# EAGLE design NotSoSmartWatch-BASIC-TOP (EAGLE 9.6.2)
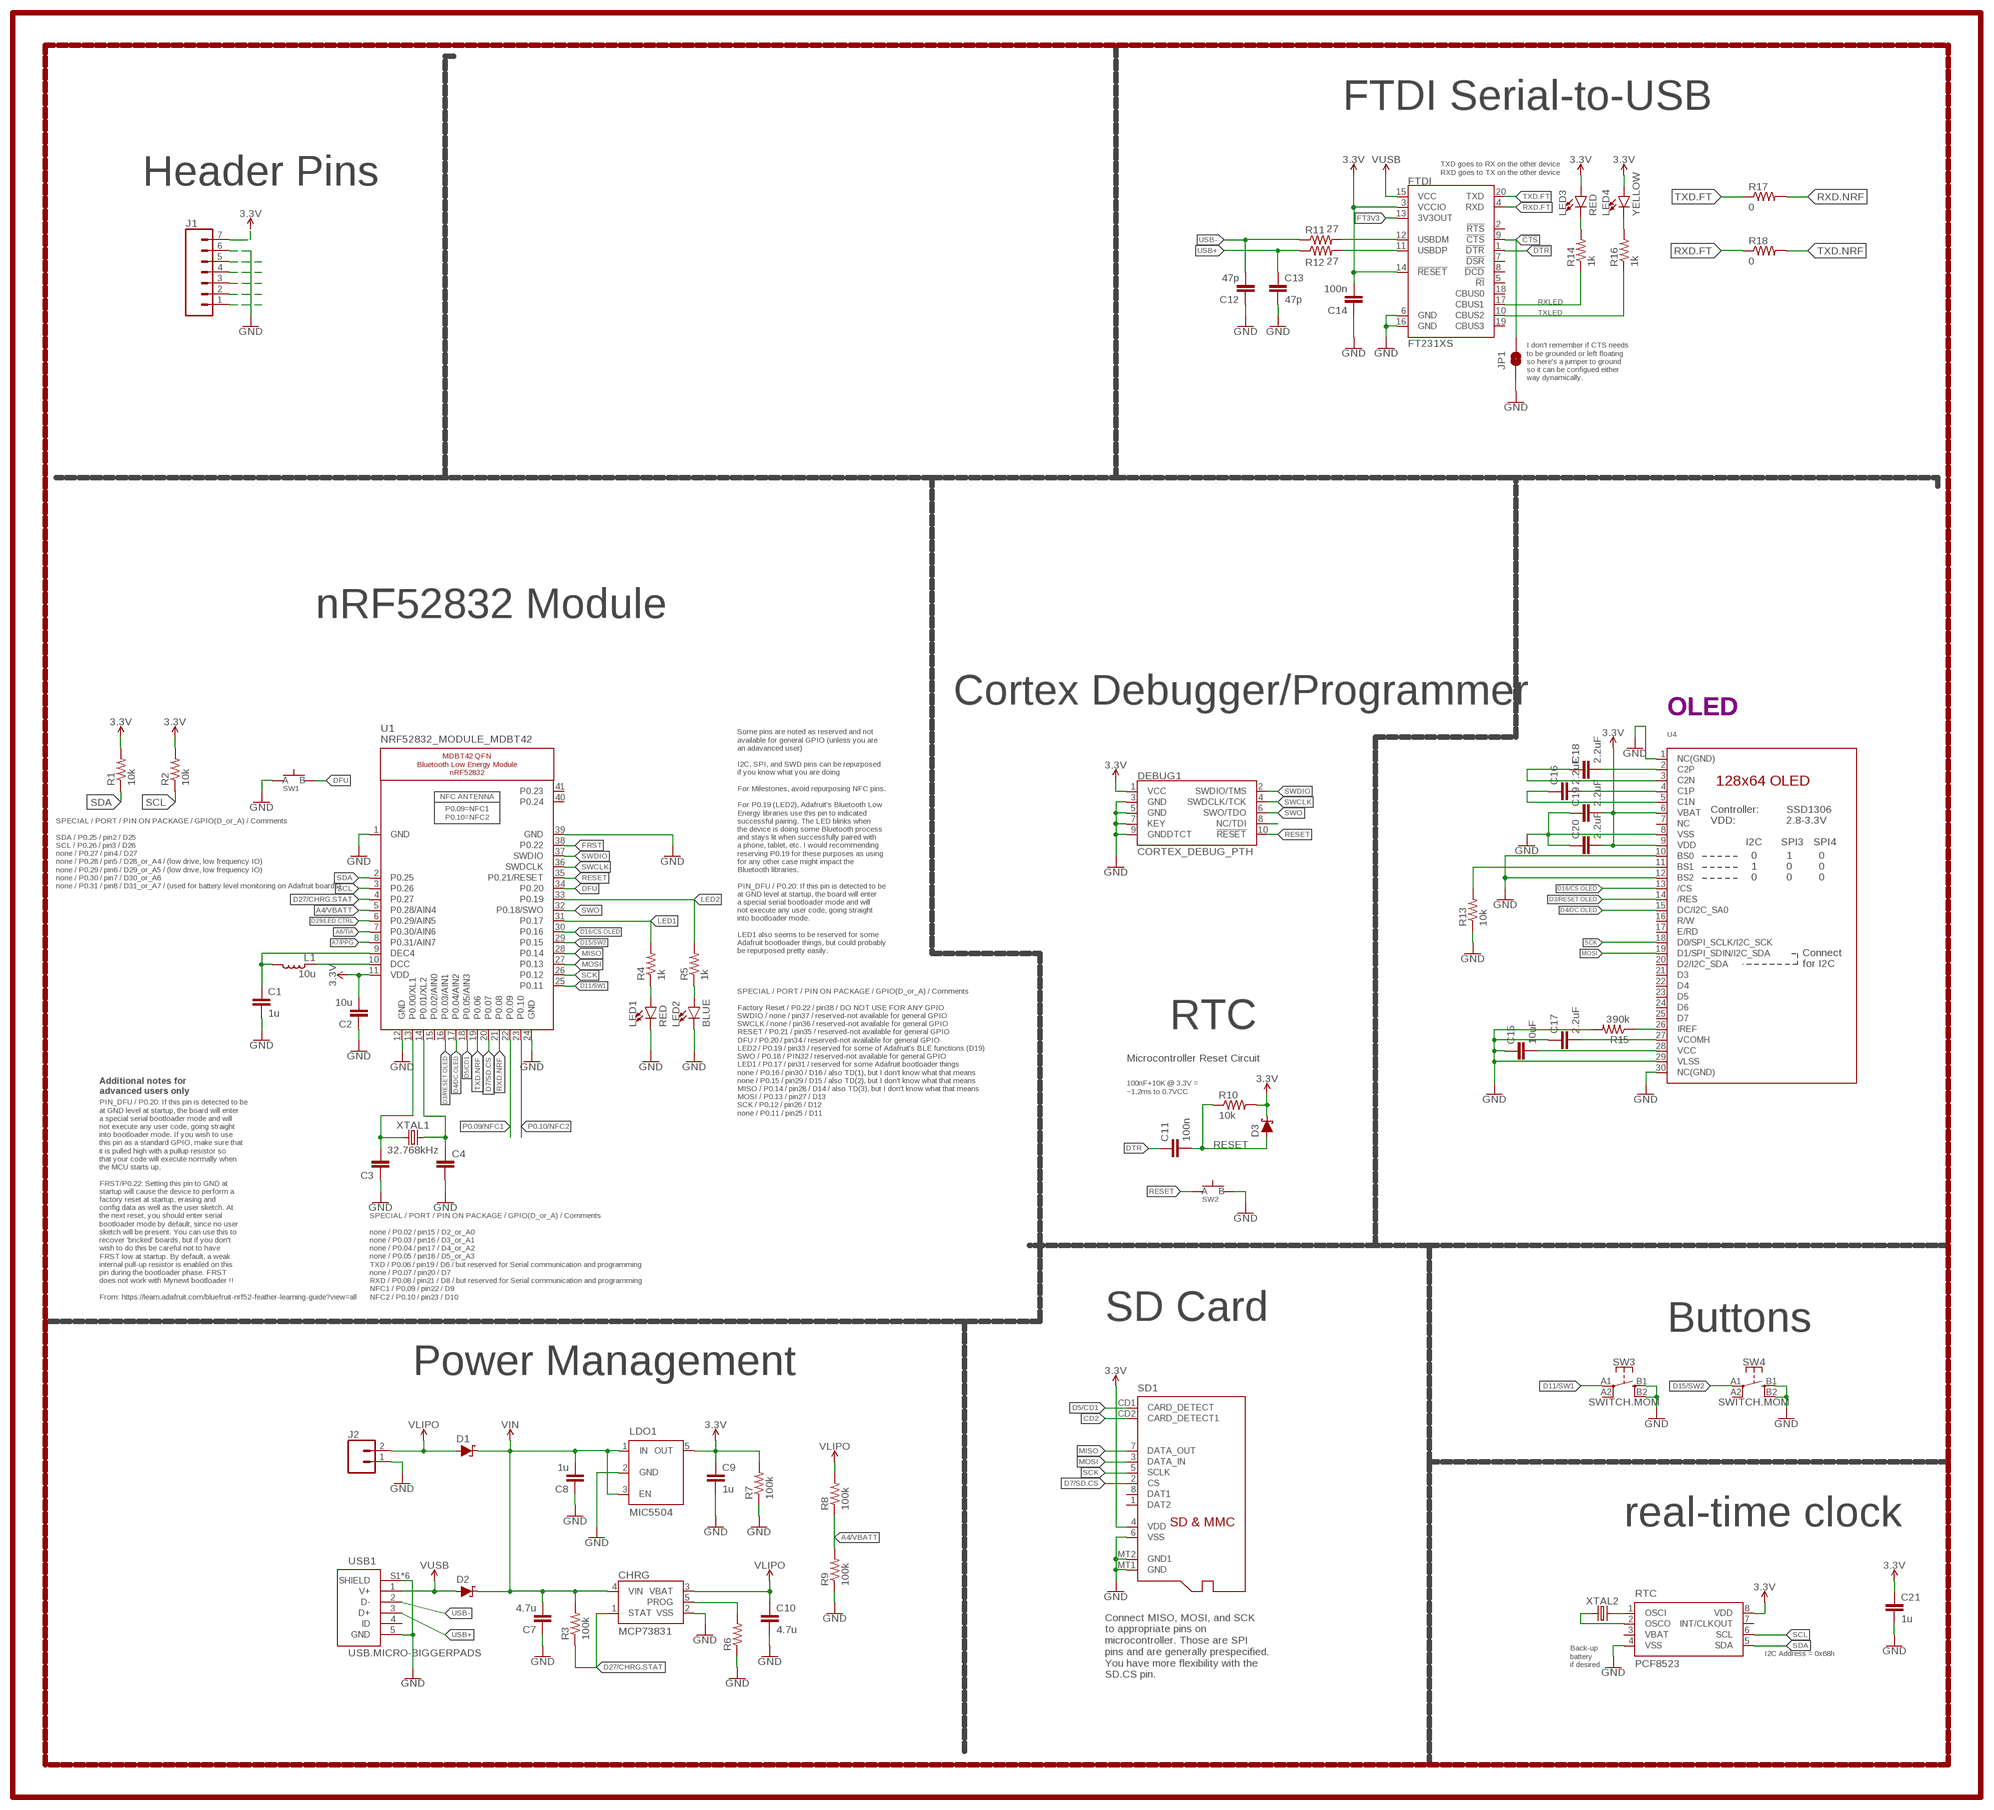
[diagram p0: schematic, sheet 1]

## Parts
C1  1u  CAPACITOR0603  [C0603]
C2  10u  CAPACITOR0805  [C0805]
C3  CAPACITOR0603  [C0603]
C4  CAPACITOR0603  [C0603]
C7  4.7u  CAPACITOR0603  [C0603]
C8  1u  CAPACITOR0603  [C0603]
C9  1u  CAPACITOR0603  [C0603]
C10  4.7u  CAPACITOR0603  [C0603]
C11  100n  CAPACITOR0603  [C0603]
C12  47p  CAPACITOR0603  [C0603]
C13  47p  CAPACITOR0603  [C0603]
C14  100n  CAPACITOR0603  [C0603]
C15  10uF  CAPACITOR0603  [C0603]
C16  2.2uF  CAPACITOR0402  [C0402]
C17  2.2uF  CAPACITOR0402  [C0402]
C18  2.2uF  CAPACITOR0402  [C0402]
C19  2.2uF  CAPACITOR0402  [C0402]
C20  2.2uF  CAPACITOR0402  [C0402]
C21  1u  CAPACITOR0603  [C0603]
CHRG  MCP73831  [SOT23-5]
D1  SCHOTTKY-USC  [USC]
D2  SCHOTTKY-USC  [USC]
D3  SCHOTTKY-USC  [USC]
DEBUG1  CORTEX_DEBUG_PTH  [2X5-PTH-1.27MM]
FTDI  FT231XS  [SSOP20_L]
J1  CONN_07-1.27MM  [1X07_1.27MM]
J2  CONN_02  [1X02]
JP1  JUMPER-SMT_2_NO_SILK  [SMT-JUMPER_2_NO_SILK]
L1  10u  INDUCTOR0603  [L0603]
LDO1  MIC5504  [SOT23-5]
LED1  RED  LED0603  [LED-0603]
LED2  BLUE  LED0603  [LED-0603]
LED3  RED  LED0603  [LED-0603]
LED4  YELLOW  LED0603  [LED-0603]
R1  10k  RESISTOR0603  [R0603]
R2  10k  RESISTOR0603  [R0603]
R3  100k  RESISTOR0603  [R0603]
R4  1k  RESISTOR0603  [R0603]
R5  1k  RESISTOR0603  [R0603]
R6  RESISTOR0603  [R0603]
R7  100k  RESISTOR0603  [R0603]
R8  100k  RESISTOR0603  [R0603]
R9  100k  RESISTOR0603  [R0603]
R10  10k  RESISTOR0603  [R0603]
R11  27  RESISTOR0603  [R0603]
R12  27  RESISTOR0603  [R0603]
R13  10k  RESISTOR0603  [R0603]
R14  1k  RESISTOR0603  [R0603]
R15  390k  RESISTOR0603  [R0603]
R16  1k  RESISTOR0603  [R0603]
R17  0  RESISTOR0603  [R0603]
R18  0  RESISTOR0603  [R0603]
RTC  PCF8523  [SO8]
SD1  MICROSD  [MICROSD]
SW1  SPST-PTS830GG140-COPY.1-3  [BUTTON-GULLWING]
SW2  SPST-PTS830GG140-COPY.1-3  [BUTTON-GULLWING]
SW3  SWITCH.MOM  [TACTILE_SWITCH_SMD_6.2MM_TALL]
SW4  SWITCH.MOM  [TACTILE_SWITCH_SMD_6.2MM_TALL]
U1  NRF52832_MODULE_MDBT42  [BLE_MODULE_RAYTAC_MDBT42]
U4  DISP_OLED_UG-2864HSWEG01-NO-WRAPAROUND  [UG-2864HSWEG01_0.96IN_NO-WRAPAROUND]
USB1  USB.MICRO-BIGGERPADS  [USB-MICRO-01.BIGGERPADS]
XTAL1  32.768kHz  CRYSTALECS-.327-12.5-12-C-TR  [2-SMD.NOLEAD.2.0MMTO1.2MM]
XTAL2  32.7680kHz  CRYSTALECS-.327-12.5-12-C-TR  [2-SMD.NOLEAD.2.0MMTO1.2MM]

## Nets
3.3V: C2.2 C9.1 C14.2 C19.2 C20.2 C21.1 D3.-(C) DEBUG1.1(VCC) FTDI.3(VCCIO) FTDI.14(!RESET) J1.7 LDO1.5(OUT) LED3.A LED4.A R1.2 R2.2 R7.2 R10.2 RTC.8(VDD) SD1.4(VDD) U1.11(VDD) U4.6(VBAT) U4.9(VDD)
!CTS: FTDI.9(!CTS) JP1.2
!DTR: FTDI.1(!DTR)
A4/VBATT: R8.1 R9.2 U1.5(P0.28/AIN4)
A6/TIA: U1.7(P0.30/AIN6)
A7/PPG: U1.8(P0.31/AIN7)
CD2: SD1.CD2(CARD_DETECT1)
D3/RESET.OLED: U1.16(P0.03/AIN1) U4.14(/RES)
D4/DC.OLED: U1.17(P0.04/AIN2) U4.15(DC/I2C_SA0)
D5/CD1: SD1.CD1(CARD_DETECT) U1.18(P0.05/AIN3)
D7/SD.CS: SD1.2(CS) U1.20(P0.07)
D11/SW1: SW3.A1 U1.25(P0.11)
D15/SW2: SW4.A1 U1.29(P0.15)
D16/CS.OLED: U1.30(P0.16) U4.13(/CS)
D27/CHRG.STAT: CHRG.1(STAT) R3.1 U1.4(P0.27)
D29/LED.CTRL: U1.6(P0.29/AIN5)
DFU: SW1.3(B) U1.34(P0.20)
DTR: C11.1
FRST: U1.38(P0.22)
FT3V3: FTDI.13(3V3OUT)
GND: C1.2 C2.1 C3.1 C4.2 C7.1 C8.1 C9.2 C10.2 C12.1 C13.2 C14.1 C15.1 C17.1 C19.1 C20.1 C21.2 CHRG.2(VSS) DEBUG1.3(GND) DEBUG1.5(GND) DEBUG1.7(KEY) DEBUG1.9(GNDDTCT) FTDI.6(GND) FTDI.16(GND) J1.6 J2.1 JP1.1 LDO1.2(GND) LED1.C LED2.C R6.1 R7.1 R9.1 R13.1 R15.2 RTC.4(VSS) SD1.6(VSS) SD1.MT1(GND) SD1.MT2(GND1) SW1.1(A) SW2.3(B) SW3.B1 SW3.B2 SW4.B1 SW4.B2 U1.1(GND) U1.12(GND) U1.24(GND) U1.39(GND) U4.1(NC(GND)) U4.8(VSS) U4.10(BS0) U4.12(BS2) U4.29(VLSS) U4.30(NC(GND)) USB1.5(GND) USB1.S1(SHIELD) USB1.S2(SHIELD) USB1.S3(SHIELD) USB1.S4(SHIELD) USB1.S5(SHIELD) USB1.S6(SHIELD)
LED1: R4.2 U1.31(P0.17)
LED2: R5.2 U1.33(P0.19)
MISO: SD1.7(DATA_OUT) U1.28(P0.14)
MOSI: SD1.3(DATA_IN) U1.27(P0.13) U4.19(D1/SPI_SDIN/I2C_SDA)
N$1: R13.2 U4.11(BS1)
N$2: R15.1 U4.26(IREF)
N$3: C18.2 U4.2(C2P)
N$4: C3.2 U1.13(P0.00/XL1) XTAL1.P$1
N$5: C18.1 U4.3(C2N)
N$6: C4.1 U1.14(P0.01/XL2) XTAL1.P$2
N$7: C16.2 U4.4(C1P)
N$8: C16.1 U4.5(C1N)
N$9: LED1.A R4.1
N$10: LED2.A R5.1
N$11: L1.1 U1.10(DCC)
N$12: C1.1 L1.2 U1.9(DEC4)
N$13: C15.2 U4.28(VCC)
N$14: DEBUG1.8(NC/TDI)
N$15: C17.2 U4.27(VCOMH)
N$17: CHRG.5(PROG) R6.2
N$19: RTC.2(OSCO) XTAL2.P$1
N$20: RTC.1(OSCI) XTAL2.P$2
N$21: J1.5
N$22: J1.4
N$23: FTDI.12(USBDM) R11.2
N$24: FTDI.11(USBDP) R12.2
N$25: LED3.C R14.2
N$26: LED4.C R16.2
N$27: J1.3
N$28: J1.2
N$29: J1.1
P0.09/NFC1: U1.22(P0.09)
P0.10/NFC2: U1.23(P0.10)
RESET: C11.2 D3.+(A) DEBUG1.10(!RESET) R10.1 SW2.1(A) U1.35(P0.21/RESET)
RXD.FT: FTDI.4(RXD) R18.1
RXD.NRF: R17.2 U1.21(P0.08)
RXLED: FTDI.17(CBUS1) R14.1
SCK: SD1.5(SCLK) U1.26(P0.12) U4.18(D0/SPI_SCLK/I2C_SCK)
SCL: R2.1 RTC.6(SCL) U1.3(P0.26)
SDA: R1.1 RTC.5(SDA) U1.2(P0.25)
SWCLK: DEBUG1.4(SWDCLK/TCK) U1.36(SWDCLK)
SWDIO: DEBUG1.2(SWDIO/TMS) U1.37(SWDIO)
SWO: DEBUG1.6(SWO/TDO) U1.32(P0.18/SWO)
TXD.FT: FTDI.20(TXD) R17.1
TXD.NRF: R18.2 U1.19(P0.06)
TXLED: FTDI.10(CBUS2) R16.1
USB+: C13.1 R12.1 USB1.3(D+)
USB-: C12.2 R11.1 USB1.2(D-)
V_USB: D2.+(A) FTDI.15(VCC) USB1.1(V+) ; supply symbol labelled VUSB
VIN: C7.2 C8.2 CHRG.4(VIN) D1.-(C) D2.-(C) LDO1.1(IN) LDO1.3(EN) R3.2
VLIPO: C10.1 CHRG.3(VBAT) D1.+(A) J2.2 R8.2
Unconnected: FTDI.2(!RTS) FTDI.5(!RI) FTDI.7(!DSR) FTDI.8(!DCD) FTDI.18(CBUS0) FTDI.19(CBUS3) RTC.7(INT/CLKOUT) SD1.1(DAT2) SD1.8(DAT1) SW3.A2 SW4.A2 U1.15(P0.02/AIN0) U1.40(P0.24) U1.41(P0.23) U4.7(NC) U4.16(R/W) U4.17(E/RD) U4.20(D2/I2C_SDA) U4.21(D3) U4.22(D4) U4.23(D5) U4.24(D6) U4.25(D7) USB1.4(ID)

## Notes on the sheet
- FTDI Serial-to-USB
- TXD goes to RX on the other device
  RXD goes to TX on the other device
- Header Pins
- I don't remember if CTS needs
  to be grounded or left floating
  so here's a jumper to ground
  so it can be configued either
  way dynamically.
- nRF52832 Module
- Cortex Debugger/Programmer
- OLED
- SPECIAL / PORT / PIN ON PACKAGE / GPIO(D_or_A) / Comments
  
  SDA / P0.25 / pin2 / D25
  SCL / P0.26 / pin3 / D26
  none / P0.27 / pin4 / D27
  none / P0.28 / pin5 / D28_or_A4 / (low drive, low frequency IO)
  none / P0.29 / pin6 / D29_or_A5 / (low drive, low frequency IO)
  none / P0.30 / pin7 / D30_or_A6
  none / P0.31 / pin8 / D31_or_A7 / (used for battery level monitoring on Adafruit boards)
- Some pins are noted as reserved and not
  available for general GPIO (unless you are
  an adavanced user)
  
  I2C, SPI, and SWD pins can be repurposed
  if you know what you are doing
  
  For Milestones, avoid repurposing NFC pins.
  
  For P0.19 (LED2), Adafruit's Bluetooth Low
  Energy libraries use this pin to indicated
  successful pairing. The LED blinks when
  the device is doing some Bluetooth process
  and stays lit when successfully paired with
  a phone, tablet, etc. I would recommending
  reserving P0.19 for these purposes as using
  for any other case might impact the
  Bluetooth libraries.
  
  PIN_DFU / P0.20: If this pin is detected to be
  at GND level at startup, the board will enter
  a special serial bootloader mode and will
  not execute any user code, going straight
  into bootloader mode.
  
  LED1 also seems to be reserved for some
  Adafruit bootloader things, but could probably
  be repurposed pretty easily.
- RTC
- Microcontroller Reset Circuit
- Additional notes for
  advanced users only
- 100nF+10K @ 3.3V =
  ~1.2ms to 0.7VCC
- SPECIAL / PORT / PIN ON PACKAGE / GPIO(D_or_A) / Comments
  
  Factory Reset / P0.22 / pin38 / DO NOT USE FOR ANY GPIO
  SWDIO / none / pin37 / reserved-not available for general GPIO
  SWCLK / none / pin36 / reserved-not available for general GPIO
  RESET / P0.21 / pin35 / reserved-not available for general GPIO
  DFU / P0.20 / pin34 / reserved-not available for general GPIO
  LED2 / P0.19 / pin33 / reserved for some of Adafruit's BLE functions (D19)
  SWO / P0.18 / PIN32 / reserved-not available for general GPIO
  LED1 / P0.17 / pin31 / reserved for some Adafruit bootloader things
  none / P0.16 / pin30 / D16 / also TD(1), but I don't know what that means
  none / P0.15 / pin29 / D15 / also TD(2), but I don't know what that means
  MISO / P0.14 / pin28 / D14 / also TD(3), but I don't know what that means
  MOSI / P0.13 / pin27 / D13
  SCK / P0.12 / pin26 / D12
  none / P0.11 / pin25 / D11
- PIN_DFU / P0.20: If this pin is detected to be
  at GND level at startup, the board will enter
  a special serial bootloader mode and will
  not execute any user code, going straight
  into bootloader mode. If you wish to use
  this pin as a standard GPIO, make sure that
  it is pulled high with a pullup resistor so
  that your code will execute normally when
  the MCU starts up.
  
  FRST/P0.22: Setting this pin to GND at
  startup will cause the device to perform a
  factory reset at startup, erasing and
  config data as well as the user sketch. At
  the next reset, you should enter serial
  bootloader mode by default, since no user
  sketch will be present. You can use this to
  recover 'bricked' boards, but if you don't
  wish to do this be careful not to have
  FRST low at startup. By default, a weak
  internal pull-up resistor is enabled on this
  pin during the bootloader phase. FRST
  does not work with Mynewt bootloader !!
  
  From: https://learn.adafruit.com/bluefruit-nrf52-feather-learning-guide?view=all
- SPECIAL / PORT / PIN ON PACKAGE / GPIO(D_or_A) / Comments
  
  none / P0.02 / pin15 / D2_or_A0
  none / P0.03 / pin16 / D3_or_A1
  none / P0.04 / pin17 / D4_or_A2
  none / P0.05 / pin18 / D5_or_A3
  TXD / P0.06 / pin19 / D6 / but reserved for Serial communication and programming
  none / P0.07 / pin20 / D7
  RXD / P0.08 / pin21 / D8 / but reserved for Serial communication and programming
  NFC1 / P0.09 / pin22 / D9
  NFC2 / P0.10 / pin23 / D10
- SD Card | Buttons
- Power Management
- real-time clock
- I2C Address = 0x68h
- Back-up
  battery
  if desired
- Connect MISO, MOSI, and SCK
  to appropriate pins on
  microcontroller. Those are SPI
  pins and are generally prespecified.
  You have more flexibility with the
  SD.CS pin.

## Power pins joined to a net without a drawn wire
VBAT: RTC.3(VBAT)

## Library data of the parts
C1-C4 C7-C11 C15-C21 = LinnesLab-Passives:CAPACITOR
C12-C14 = LinnesLab-Passives:CAPACITOR; SPICEPREFIX: C
CHRG = LinnesLab-Power:MCP73831: MCP73831T Li-Ion, Li-Pol Controller Miniature single cell, fully integrated Li-Ion, Li-polymer charge management controller Datasheet <http://ww1.microchip.com/downloads/en/DeviceDoc/20001984g.pdf> SparkFun Products: SparkFun ESP32 Thing <https://www.sparkfun.com/products/13907> SparkFun 9DoF Razor IMU M0 <https://www.sparkfun.com/products/14001>; PROD_ID: IC-09995
D1-D3 = LinnesLab-DiscreteSemi:SCHOTTKY: Schottky diode A Schottky diode is a semiconductor diode which has a low forward voltage drop and a very fast switching action. Example: Digi-Key Part Number: RB161MM-20CT-ND
DEBUG1 = LinnesLab-Connectors:CORTEX_DEBUG: Cortex Debug Connector - 10 pin Supports JTAG debug, Serial Wire debug, and Serial Wire Viewer. PTH and SMD connector options available. General Connector Information <http://infocenter.arm.com/help/topic/com.arm.doc.faqs/attached/13634/cortex_debug_connectors.pdf> Products: PTH Connector <http://www.digikey.com/product-detail/en/cnc-tech/3220-10-0100-00/1175-1627-ND/3883661> -via Digi-Key SparkFun PSoc <https://www.sparkfun.com/products/13229> SparkFun T <https://www.sparkfun.com/products/13810>
FTDI = LinnesLab-DigitalIC:FT231X: FTDI FT231X Full Speed USB to Full-handshake UART This USB2.0 Full Speed IC offers a compact bridge to full handshake UART interfaces. The device is a UART, capable of operating up to 3MBaud, with low power consumption (8mA). The FT231X includes the complete FT-X series feature set and enables USB to be added into a system design quickly and easily over a UART interface. Datasheet <http://cdn.sparkfun.com/datasheets/Components/General%20IC/DS_FT231X.pdf>; DIGIKEY: 768-1156-5-ND; MFN: FT231XS-U; SPICEPREFIX: X
J1 = LinnesLab-Connectors:CONN_07: Multi connection point. Often used as Generic Header-pin footprint for 0.1 inch spaced/style header connections On any of the 0.1 inch spaced packages, you can populate with these: Break Away Headers - Straight <https://www.sparkfun.com/products/116> (PRT-00116) Break Away Male Headers - Right Angle <https://www.sparkfun.com/products/553> (PRT-00553) Female Headers <https://www.sparkfun.com/products/115> (PRT-00115) Break Away Headers - Machine Pin <https://www.sparkfun.com/products/117> (PRT-00117) Break Away Female Headers - Swiss Machine Pin <https://www.sparkfun.com/products/743> (PRT-00743) For SCREWTERMINALS and SPRING TERMINALS visit here: Screw Terimnals on SparkFun.com <https://www.sparkfun.com/search/results?term=Screw+Terminals> (5mm/3.5mm/2.54mm spacing) This device is also useful as a general connection point to wire up your design to another part of your project. Our various solder wires solder well into these plated through hole pads. Hook-Up Wire - Assortment (Stranded, 22 AWG) <https://www.sparkfun.com/products/11375> (PRT-11375) Hook-Up Wire - Assortment (Solid Core, 22 AWG) <https://www.sparkfun.com/products/11367> (PRT-11367) View the entire wire category on our website here <https://www.sparkfun.com/categories/141> Special notes: Molex polarized connector foot print use with SKU : PRT-08231 with associated crimp pins and housings. 1MM SMD Version SKU: PRT-10208 NOTES ON THE VARIANTS LOCK and LOCK_LONGPADS... This footprint was designed to help hold the alignment of a through-hole component (i.e. 6-pin header) while soldering it into place. You may notice that each hole has been shifted either up or down by 0.005 of an inch from it's more standard position (which is a perfectly straight line). This slight alteration caused the pins (the squares in the middle) to touch the edges of the holes. Because they are alternating, it causes a "brace" to hold the component in place. 0.005 has proven to be the perfect amount of "off-center" position when using our standard breakaway headers. Although looks a little odd when you look at the bare footprint, once you have a header in there, the alteration is very hard to notice. Also,if you push a header all the way into place, it is covered up entirely on the bottom side.
J2 = LinnesLab-Connectors:CONN_02: Multi connection point. Often used as Generic Header-pin footprint for 0.1 inch spaced/style header connections On any of the 0.1 inch spaced packages, you can populate with these: Break Away Headers - Straight <https://www.sparkfun.com/products/116> (PRT-00116) Break Away Male Headers - Right Angle <https://www.sparkfun.com/products/553> (PRT-00553) Female Headers <https://www.sparkfun.com/products/115> (PRT-00115) Break Away Headers - Machine Pin <https://www.sparkfun.com/products/117> (PRT-00117) Break Away Female Headers - Swiss Machine Pin <https://www.sparkfun.com/products/743> (PRT-00743) For SCREWTERMINALS and SPRING TERMINALS visit here: Screw Terimnals on SparkFun.com <https://www.sparkfun.com/search/results?term=Screw+Terminals> (5mm/3.5mm/2.54mm spacing) This device is also useful as a general connection point to wire up your design to another part of your project. Our various solder wires solder well into these plated through hole pads. Hook-Up Wire - Assortment (Stranded, 22 AWG) <https://www.sparkfun.com/products/11375> (PRT-11375) Hook-Up Wire - Assortment (Solid Core, 22 AWG) <https://www.sparkfun.com/products/11367> (PRT-11367) View the entire wire category on our website here <https://www.sparkfun.com/categories/141> Special notes: Molex polarized connector foot print use with: PRT-08233 with associated crimp pins and housings. 2.54_SCREWTERM for use with PRT-10571. 3.5mm Screw Terminal footprints for PRT-08084 5mm Screw Terminal footprints for use with PRT-08432
JP1 = LinnesLab-Switches:JUMPER-SMT_2_NO: Normally open jumper This jumper has two pads in close proximity to each other. Apply solder to close the connection. Round pads are easier to solder for beginners, but are a lot larger. SparkFun Product that uses the round pads: SparkFun EL Sequencer <https://www.sparkfun.com/products/12781>; SPICEPREFIX: B
L1 = LinnesLab-Passives:INDUCTOR
LDO1 = LinnesLab-Power:MIC5504: MIC5504 Voltage Regulator Output Voltages: 1.0V to 3.3V Input Voltages: 2.5V to 5.5V Link to Datasheet http://ww1.microchip.com/downloads/en/DeviceDoc/MIC550X.pdf
LED1 LED2 = LinnesLab-LED:LED: LED (Generic) Standard schematic elements and footprints for 5mm, 3mm, 1206, and 0603 sized LEDs. Generic LEDs with no color specified. LTST-C190KGKT: arrow indicates cathode
LED3 LED4 = LinnesLab-LED:LED: LED (Generic) Standard schematic elements and footprints for 5mm, 3mm, 1206, and 0603 sized LEDs. Generic LEDs with no color specified. LTST-C190KGKT: arrow indicates cathode; SPICEPREFIX: L
R1-R10 R13 R15 R17 R18 = LinnesLab-Passives:RESISTOR
R11 R12 R14 R16 = LinnesLab-Passives:RESISTOR; SPICEPREFIX: R
RTC = LinnesLab-Clocks:PCF8523; DIGIKEY: 568-5306-1-ND; I2C_ADDRESS: 0x68h; MFN: PCF8523T/1,118; MFN_MANUFACTURER: NXP USA Inc.
SD1 = LinnesLab-Connectors:MICROSD: Micro-SD / Transflash card holder with SPI pinout For the 3M # 2908-05WB-MG and/or 4UCON #19656 push-push type
SW1 SW2 = LinnesLab-Switches:SPST-PTS830GG140-COPY
SW3 SW4 = LinnesLab-Switches:SWITCH.MOM: PTS645SM43SMTR92 LFS
U1 = LinnesLab-Microcontrollers:NRF52832_MODULE_MDBT42: MDBT42 - BLE Module (nRF52832 QFN) VDD: 1.7-3.6V
U4 = LinnesLab-Displays:DISP_OLED_UG-2864HSWEG01: UG-2864HSWEG01 OLED display Both 1.3" and 0.96" models share the same FPC tab footprint, only the screen dimensions vary.
USB1 = LinnesLab-Connectors:USB.MICRO: DigiKey PN: 609-4613-1-ND
XTAL1 XTAL2 = LinnesLab-Clocks:CRYSTAL; DIGIKEY: XC2288CT-ND; FREQ: 32.7680KHZ; LOAD_CAP: 12.5pF

## Board
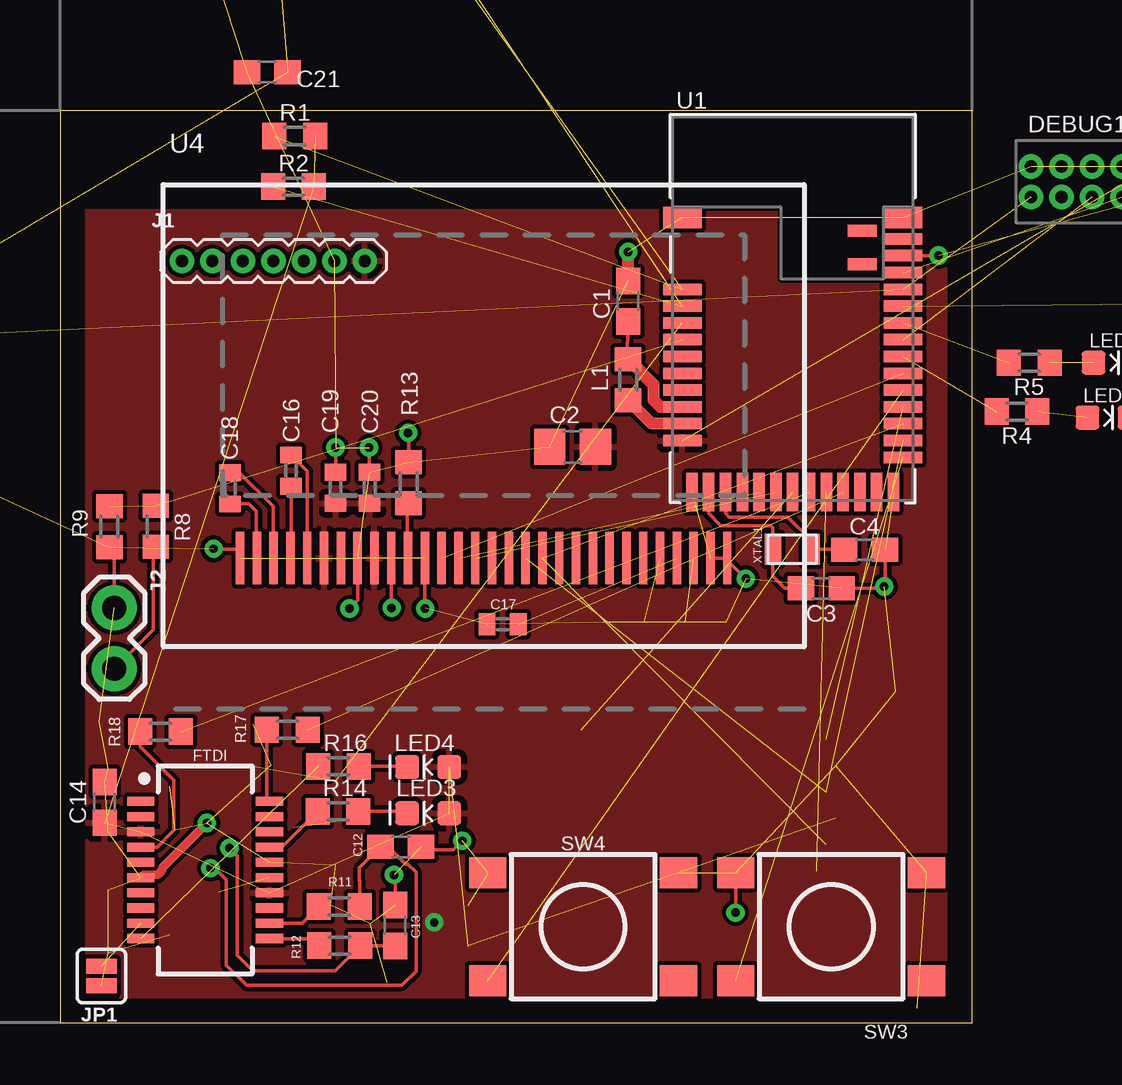
[diagram p1: board, top side]
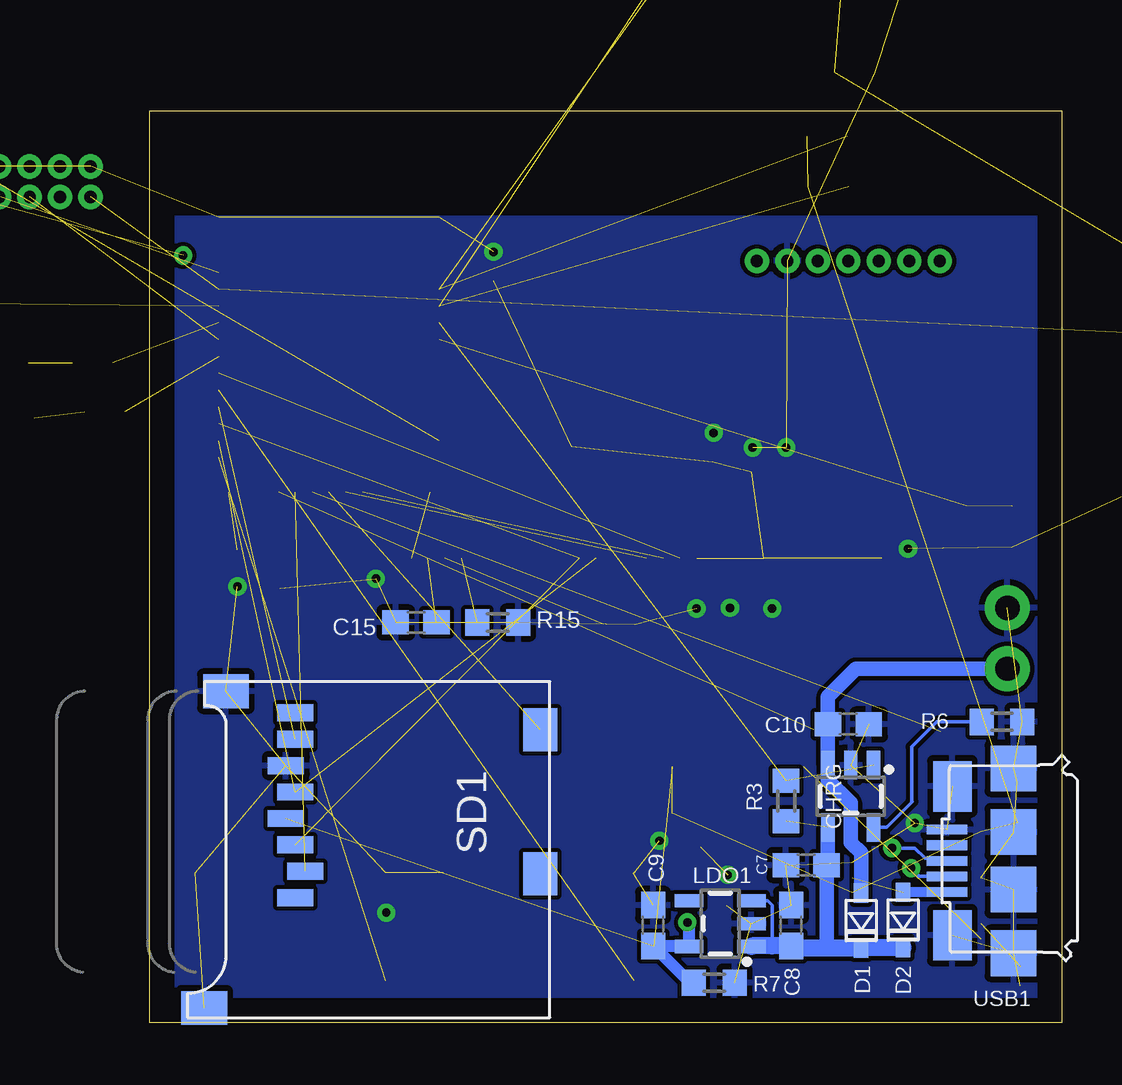
[diagram p2: board, bottom side, seen from below]

Size 38 x 38 mm. Coordinates in mm from the lower left corner, seen from the top.
Outline: 0,0 38,0 38,38 0,38 0,0
Copper layers (1*16): Top 0.035mm / dielectric 1.5mm / Bottom 0.035mm
Design rules "default": minimum track width 6mil, minimum drill 0.35mm, track to track 6mil, track to pad 6mil, pad to pad 6mil, via to via 6mil, smd to smd 6mil, copper to edge 40mil, drill to drill 6mil, minimum pad ring 10mil, minimum via ring 8mil, stop-mask expansion 4mil, vias tented up to drill 0mil, thermal gap 10mil

### Footprints (pad centres in the part's own frame; a part is rotated, then mirrored left to right if it is on the bottom)
C0603 = smd 1.1 x 1: 1 -0.85,0; 2 0.85,0
C0805 = smd 1.3 x 1.5: 1 -0.95,0; 2 0.95,0
C0402 = smd 0.7 x 0.9: 1 -0.65,0; 2 0.65,0
SOT23-5 = smd 0.55 x 1.2: 1 -0.95,-1.3; 2 0,-1.3; 3 0.95,-1.3; 4 0.95,1.3; 5 -0.95,1.3
USC = smd 0.8 x 0.6: + -1.15,0; - 1.15,0
2X5-PTH-1.27MM = drill 0.508 pad 1: 1 -2.54,-0.635; 2 -2.54,0.635; 3 -1.27,-0.635; 4 -1.27,0.635; 5 0,-0.635; 6 0,0.635; 7 1.27,-0.635; 8 1.27,0.635; 9 2.54,-0.635; 10 2.54,0.635
SSOP20_L = smd 0.381 x 1.143: 1 -2.857,-2.68; 2 -2.223,-2.68; 3 -1.587,-2.68; 4 -0.953,-2.68; 5 -0.318,-2.68; 6 0.318,-2.68; 7 0.953,-2.68; 8 1.587,-2.68; 9 2.223,-2.68; 10 2.857,-2.68; 11 2.857,2.68; 12 2.223,2.68; 13 1.587,2.68; 14 0.953,2.68; 15 0.318,2.68; 16 -0.318,2.68; 17 -0.953,2.68; 18 -1.587,2.68; 19 -2.223,2.68; 20 -2.857,2.68
1X07_1.27MM = drill 0.508 pad 1: 1 0,0; 2 1.27,0; 3 2.54,0; 4 3.81,0; 5 5.08,0; 6 6.35,0; 7 7.62,0
1X02 = drill 1.016 pad 1.88: 1 0,0; 2 2.54,0
SMT-JUMPER_2_NO_SILK = smd 0.635 x 1.27: 1 -0.406,0; 2 0.406,0
L0603 = smd 1 x 1.1: 1 -0.85,0; 2 0.85,0
LED-0603 = smd 1 x 1: A -0.877,0; C 0.877,0
R0603 = smd 1 x 1.1: 1 -0.85,0; 2 0.85,0
SO8 = smd 1.3 x 0.6: 1 -2.65,1.905; 2 -2.65,0.635; 3 -2.65,-0.635; 4 -2.65,-1.905; 5 2.65,-1.905; 6 2.65,-0.635; 7 2.65,0.635; 8 2.65,1.905
MICROSD = smd 0.7 x 1.5: 1 9,-10.64; 2 7.9,-10.24; 3 6.8,-10.64; 4 5.7,-11.04; 5 4.6,-10.64; 6 3.5,-11.04; 7 2.4,-10.64; 8 1.3,-10.64 | smd 1.8 x 1.4: CD1 2,-0.44; CD2 8,-0.44 | smd 1.4 x 1.9: MT1 0.4,-13.54; MT2 13.6,-14.44
BUTTON-GULLWING = smd 0.7 x 0.75: 1 -1.6,0.825; 2 1.6,0.825; 3 -1.6,-0.825; 4 1.6,-0.825
TACTILE_SWITCH_SMD_6.2MM_TALL = smd 1.55 x 1.3: A1 -3.975,-2.25; A2 3.975,-2.25; B1 -3.975,2.25; B2 3.975,2.25
BLE_MODULE_RAYTAC_MDBT42 = smd 1.6 x 0.9: 1 -4.6,3.8; 39 4.6,3.8 | smd 1.6 x 0.48: 2 -4.6,0.8; 3 -4.6,0.1; 4 -4.6,-0.6; 5 -4.6,-1.3; 6 -4.6,-2; 7 -4.6,-2.7; 8 -4.6,-3.4; 9 -4.6,-4.1; 10 -4.6,-4.8; 11 -4.6,-5.5; 25 4.6,-6.2; 26 4.6,-5.5; 27 4.6,-4.8; 28 4.6,-4.1; 29 4.6,-3.4; 30 4.6,-2.7; 31 4.6,-2; 32 4.6,-1.3; 33 4.6,-0.6; 34 4.6,0.1; 35 4.6,0.8; 36 4.6,1.5; 37 4.6,2.2; 38 4.6,2.9 | smd 0.48 x 1.6: 12 -4.2,-7.65; 13 -3.5,-7.65; 14 -2.8,-7.65; 15 -2.1,-7.65; 16 -1.4,-7.65; 17 -0.7,-7.65; 18 0,-7.65; 19 0.7,-7.65; 20 1.4,-7.65; 21 2.1,-7.65; 22 2.8,-7.65; 23 3.5,-7.65; 24 4.2,-7.65 | smd 1.2 x 0.5: 40 2.9,3.25; 41 2.9,1.85
UG-2864HSWEG01_0.96IN_NO-WRAPAROUND = smd 0.35 x 2.2: 1 -10.15,-1.2; 2 -9.45,-1.2; 3 -8.75,-1.2; 4 -8.05,-1.2; 5 -7.35,-1.2; 6 -6.65,-1.2; 7 -5.95,-1.2; 8 -5.25,-1.2; 9 -4.55,-1.2; 10 -3.85,-1.2; 11 -3.15,-1.2; 12 -2.45,-1.2; 13 -1.75,-1.2; 14 -1.05,-1.2; 15 -0.35,-1.2; 16 0.35,-1.2; 17 1.05,-1.2; 18 1.75,-1.2; 19 2.45,-1.2; 20 3.15,-1.2; 21 3.85,-1.2; 22 4.55,-1.2; 23 5.25,-1.2; 24 5.95,-1.2; 25 6.65,-1.2; 26 7.35,-1.2; 27 8.05,-1.2; 28 8.75,-1.2; 29 9.45,-1.2; 30 10.15,-1.2
USB-MICRO-01.BIGGERPADS = smd 0.4 x 1.7: 1 -1.3,1.505; 2 -0.65,1.505; 3 0,1.505; 4 0.65,1.505; 5 1.3,1.505 | smd 1.9 x 1.9: S1 -3.85,-1.27; S2 -1.2,-1.27; S3 1.2,-1.27; S4 3.85,-1.27 | smd 2.1 x 1.6: S5 -3.1,1.28; S6 3.1,1.28
2-SMD.NOLEAD.2.0MMTO1.2MM = smd 0.7 x 1.3: P$1 -0.8,0; P$2 0.8,0

### Placement (x,y rotation side)
C1  23.67,30.07 90 top
C2  21.36,24 0 top
C3  31.72,18.11 180 top
C4  33.53,19.71 0 top
C7  10.64,6.58 0 bottom
C8  11.28,4.06 270 bottom
C9  17.02,4.06 90 bottom
C10  8.89,12.45 0 bottom
C11  -16.59,26.37 180 top  (outside the outline)
C12  14.2,7.34 180 top
C13  13.97,4.06 90 top
C14  1.85,9.19 270 top
C15  26.9,16.69 0 bottom
C16  9.63,23.01 270 top
C17  18.44,16.61 0 top
C18  7.09,22.28 270 top
C19  11.48,22.3 270 top
C20  12.9,22.3 270 top
C21  8.64,39.62 180 top
CHRG  8.79,9.45 180 bottom
D1  8.36,4.27 270 bottom
D2  6.6,4.29 270 bottom
D3  -16.66,22.81 0 top  (outside the outline)
DEBUG1  43,35.05 180 top
FTDI  6.05,6.38 270 top
J1  5.08,31.75 0 top
J2  2.26,17.3 270 top
JP1  1.73,1.96 90 top
L1  23.67,26.8 90 top
LDO1  14.22,4.14 90 bottom
LED1  43.69,25.22 0 top  (outside the outline)
LED2  43.94,27.51 0 top  (outside the outline)
LED3  15.34,8.74 180 top
LED4  15.34,10.67 180 top
R1  9.78,36.96 0 top
R2  9.73,34.85 0 top
R3  11.48,9.25 270 bottom
R4  39.88,25.48 180 top
R5  40.39,27.51 180 top
R6  2.49,12.55 180 bottom
R7  14.48,1.68 180 bottom
R8  3.99,20.7 270 top
R9  2.06,20.68 90 top
R10  -16.59,24.66 0 top  (outside the outline)
R11  11.63,4.85 180 top
R12  11.66,3.23 180 top
R13  14.53,22.5 270 top
R14  11.58,8.81 0 top
R15  23.5,16.69 0 bottom
R16  11.61,10.69 0 top
R17  9.47,12.22 0 top
R18  4.19,12.14 0 top
RTC  5.18,57.84 0 top  (outside the outline)
SD1  21.29,14.22 270 bottom
SW1  49.15,30.81 0 top  (outside the outline)
SW2  -16.66,29.64 90 top  (outside the outline)
SW3  32.13,4.01 0 top
SW4  21.79,4.01 0 top
U1  30.53,29.77 0 top
U4  17.65,20.57 0 top
USB1  3.28,6.76 90 bottom
XTAL1  30.51,19.74 0 top
XTAL2  -1.19,58.42 90 top  (outside the outline)

### Tracks (layer width: path | path; a pad name or v marks a point on that pad's centre or on a via)
3.3V  (via drill 0.35 pad 0.51)  (12 unrouted)
  Bottom 0.508: v15.6,4.19 15.52,4.12 LDO1.5 16.99,3.19 | 16.99,3.19 C9.1 | R7.2 15.48,1.68 16.99,3.19
  pour Top (isolate 0.178): 37.72,33.83 0.33,33.83 0.33,0.41 37.72,0.41
!CTS  (1 unrouted)
A4/VBATT  (2 unrouted)
D3/RESET.OLED  (1 unrouted)
D4/DC.OLED  (1 unrouted)
D5/CD1  (1 unrouted)
D7/SD.CS  (1 unrouted)
D11/SW1  (1 unrouted)
D15/SW2  (1 unrouted)
D16/CS.OLED  (1 unrouted)
D27/CHRG.STAT  (2 unrouted)
DFU  (1 unrouted)
GND  (via drill 0.35, 0.35 pad 0.51)  (57 unrouted)
  Top 0.152: U4.1 7.5,19.74 6.4,19.74 v6.4,19.76 | v14.5,24.59 14.53,24.56 R13.1 | C19.1 v11.48,23.98 | C20.1 12.88,22.98 v12.88,23.98 | U4.8 12.4,17.61 v12.06,17.27 | U4.10 13.8,17.31 v13.82,17.3 | U4.12 15.2,17.28 v15.21,17.27 | U4.29 U4.30 27.8,19.29 v28.57,18.52 | SW3.B1 28.16,4.61 v28.14,4.6 | SW4.B1 17.84,6.24 | C12.1 15.23,7.21 16.38,7.21 v16.76,7.59 | C13.2 13.97,6.12 v13.92,6.17 | J2.1 2.26,19.62 R9.1 | C3.1 34.27,18.11 v34.34,18.19 34.38,18.22 C4.2
  Top 0.356: FTDI.6 3.48,6.17 4.07,6.17 4.27,6.37 4.27,6.48 v6.12,8.33
  Top 0.508: C1.2 v23.67,32.13
  pour Bottom (isolate 0.178): 37.34,33.58 0.56,33.58 0.56,0.71 37.34,0.71
LED1  (1 unrouted)
LED2  (1 unrouted)
MISO  (1 unrouted)
MOSI  (2 unrouted)
N$1
  Top 0.152: R13.2 14.48,21.6 14.48,19.4 U4.11
N$2  (1 unrouted)
N$3
  Top 0.152: C18.2 7.86,21.63 8.18,21.31 8.18,19.4 U4.2
N$4
  Top 0.152: U1.13 27.03,21.23 27.53,20.73 29.62,20.73 29.7,20.64 XTAL1.P$1 29.7,18.61 30.2,18.11 C3.2
N$5
  Top 0.152: C18.1 7.48,22.93 8.88,21.53 8.88,19.4 U4.3
N$6
  Top 0.152: U1.14 27.73,21.24 27.89,21.08 30.33,21.08 31.3,20.1 XTAL1.P$2 32.65,19.74 C4.1
N$7
  Top 0.152: U4.4 9.64,19.41 C16.2
N$8
  Top 0.152: U4.5 10.3,21.92 10.3,22.98 C16.1
N$9  (1 unrouted)
N$10  (1 unrouted)
N$11
  Top 0.508: U1.10 24.65,24.97 L1.1
N$12
  Top 0.152: L1.2 23.61,27.58 C1.1 | L1.2 23.75,27.65 | 24.14,27.65 L1.2
  Top 0.508: L1.2 24.72,26.59 24.72,25.96 25.02,25.67 U1.9
N$13  (1 unrouted)
N$15  (1 unrouted)
N$17
  Bottom 0.152: R6.2 5.21,12.55 6.25,11.51 6.25,9.25 6.22,9.22 7.29,8.15 CHRG.5
N$19  (1 unrouted)
N$20  (1 unrouted)
N$23
  Top 0.152: FTDI.12 10.09,4.15 R11.2
N$24
  Top 0.152: FTDI.11 10.52,3.52 R12.2
N$25
  Top 0.152: LED3.C 14.39,8.81 R14.2
N$26
  Top 0.152: LED4.C 14.44,10.69 R16.2
RESET  (5 unrouted)
RXD.FT
  Top 0.152: R18.1 3.34,11.52 4.75,10.11 4.75,8.03 4.05,7.33 FTDI.4
RXD.NRF  (1 unrouted)
RXLED
  Top 0.152: FTDI.17 9.25,7.33 R14.1
SCK  (2 unrouted)
SCL  (2 unrouted)
SDA  (2 unrouted)
SWCLK  (1 unrouted)
SWDIO  (via drill 0.35 pad 0.51)  (1 unrouted)
  Top 0.152: U1.37 36.6,31.97 v36.61,31.98
SWO  (1 unrouted)
TXD.FT
  Top 0.152: R17.1 8.62,9.33 FTDI.20
TXD.NRF  (1 unrouted)
TXLED  (1 unrouted)
USB+  (via drill 0.35 pad 0.51)
  Top 0.152: C13.1 13.96,3.23 R12.1 11.47,2.18 8.03,2.18 7.39,2.82 7.39,6.96 v7.06,7.29
  Bottom 0.152: USB1.3 4.88,6.86 5.69,6.86 6.12,7.29 v7.06,7.29
USB-  (via drill 0.35 pad 0.51)
  Top 0.152: 12.63,4.85 R11.1 12.48,5.93 12.47,5.94 12.47,6.46 C12.2 13.68,7.34 14.4,6.61 14.49,6.61 14.83,6.27 14.83,2.16 14.24,1.57 7.77,1.57 6.93,2.41 6.93,5.97 6.45,6.45 v6.27,6.45
  Bottom 0.152: USB1.2 5.93,6.11 v6.27,6.45
V_USB  (1 unrouted)
  Bottom 0.406: USB1.1 5.5,5.46 D2.+
VIN  (1 unrouted)
  Bottom 0.152: LDO1.3 12.25,5.09 12.06,4.9 12.06,3.21
  Bottom 0.61: 9.84,3.12 9.79,3.17 C7.2 9.74,6.63 CHRG.4
  Bottom 0.711: D2.- 8.33,3.14 D1.- 9.84,3.12 11.18,3.12 C8.2 12.06,3.21 12.9,3.21 LDO1.1
VLIPO
  Top 0.152: J2.2 3.89,16.38 3.89,19.75 R8.2
  Bottom 0.61: J2.2 8.59,14.76 9.74,13.6 C10.1 CHRG.3 9.74,10.12 8.79,9.17 8.79,7.52 8.36,7.09 D1.+